# EAGLE design Prototipo_1.0 (EAGLE 6.1)
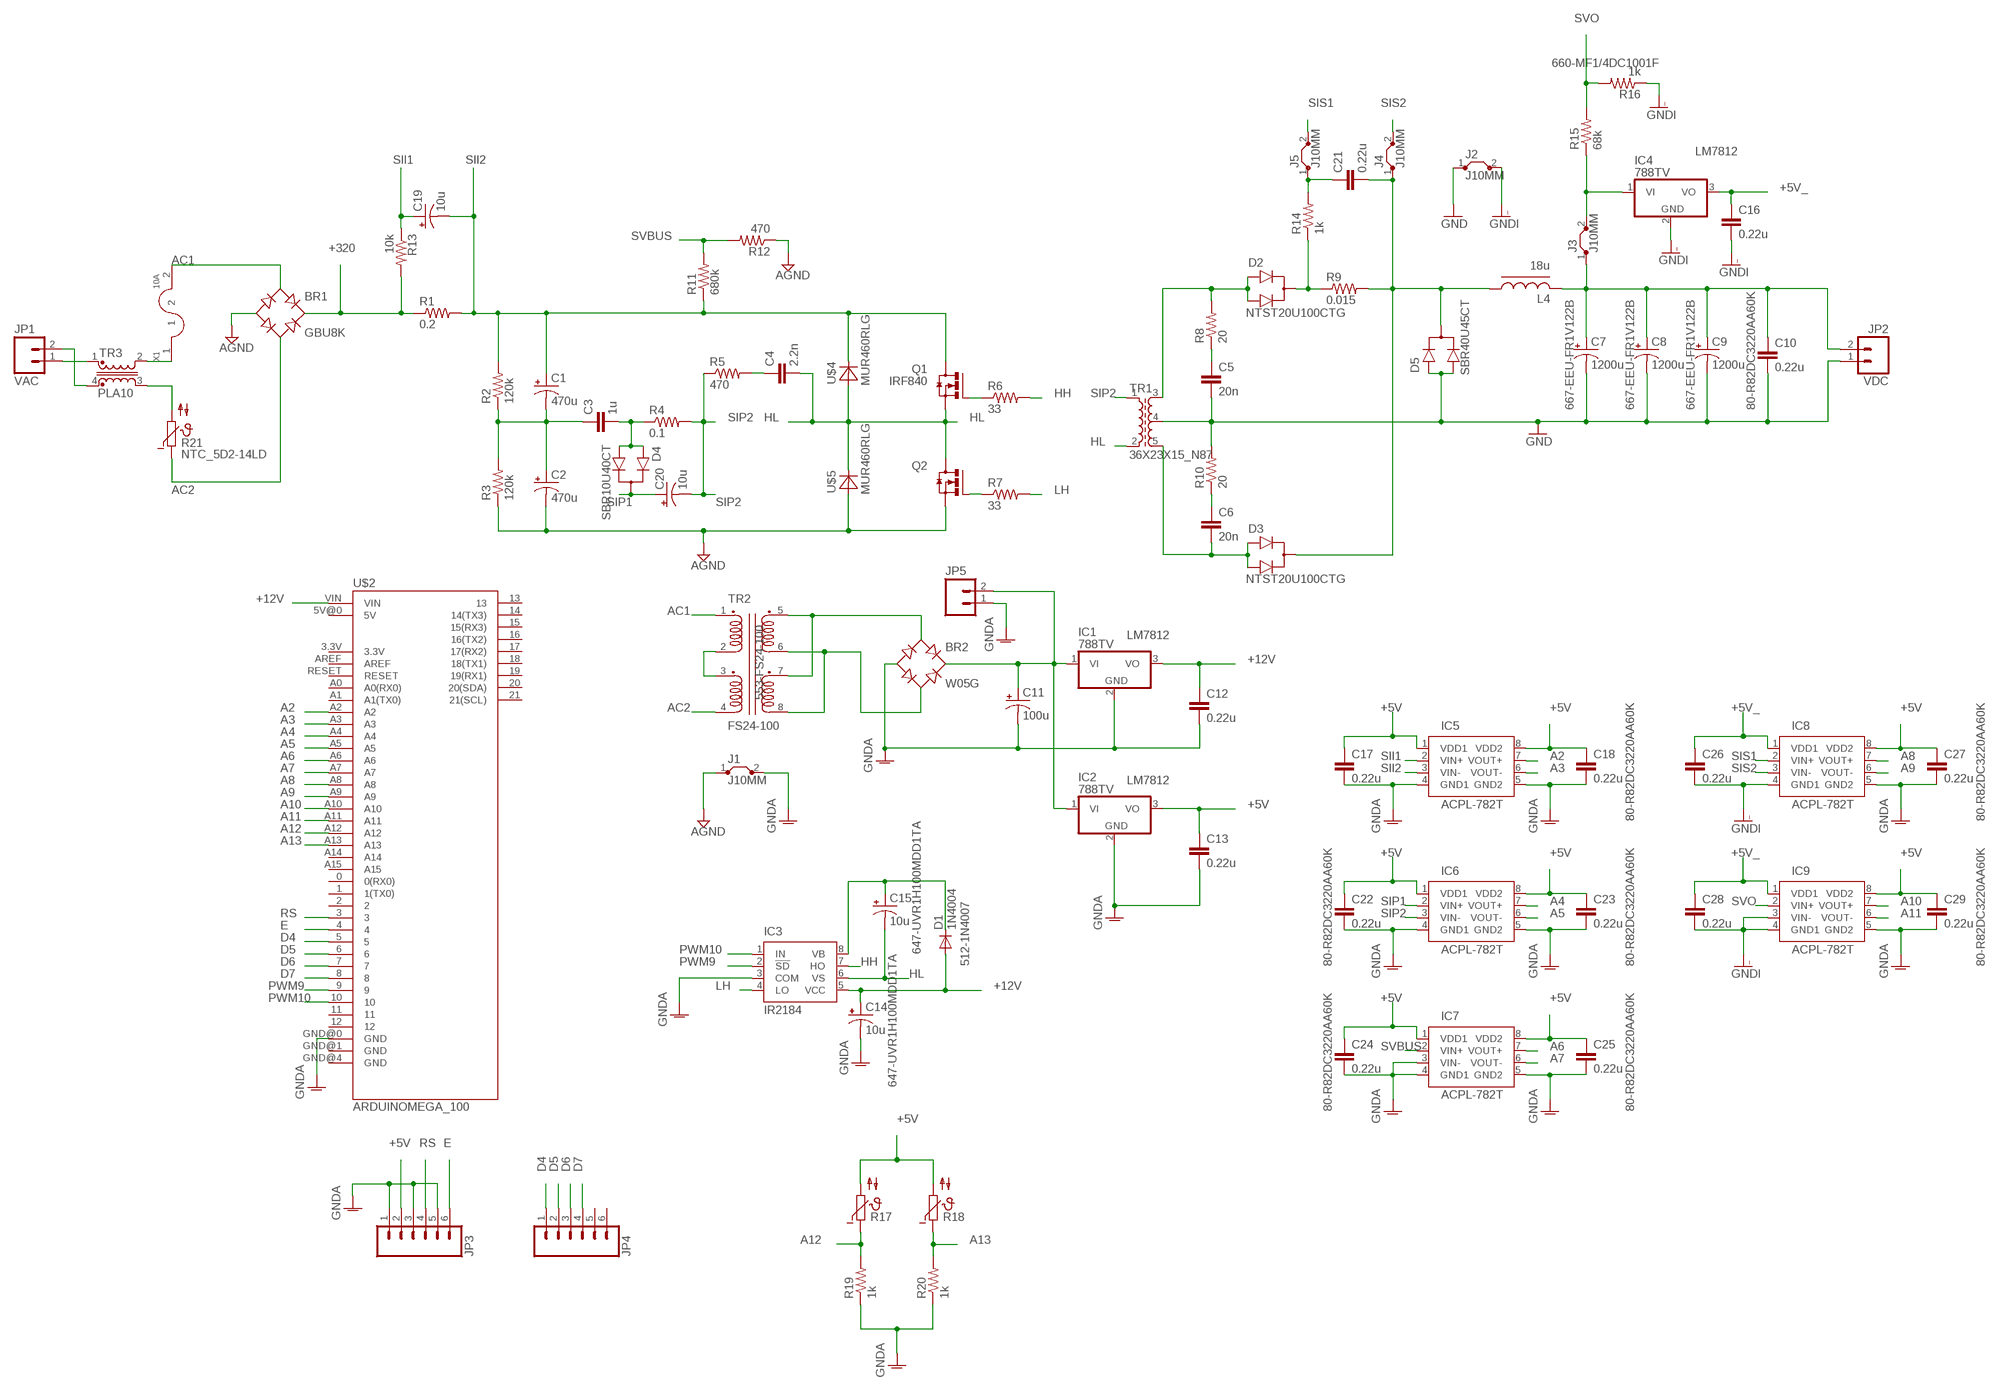
[diagram p0: schematic, sheet 1]

## Parts
BR1  GBU8K  [GBU]
BR2  W05G  [WOG]
C1  470u  CAP_470UF_250V  [CPOL_RADIAL_470UF_250V]
C2  470u  CAP_470UF_250V  [CPOL_RADIAL_470UF_250V]
C3  1u  C22/8  [C22.5B8]
C4  2.2n  C7.5/4  [C7.5B4]
C5  20n  C10/4  [C10B4]
C6  20n  C10/4  [C10B4]
C7  1200u  CAP_POLPTH4  [CPOL-RADIAL-1000UF-25V]
C8  1200u  CAP_POLPTH4  [CPOL-RADIAL-1000UF-25V]
C9  1200u  CAP_POLPTH4  [CPOL-RADIAL-1000UF-25V]
C10  0.22u  C5/3  [C5B3]
C11  100u  CPOL-USE3.5-8  [E3,5-8]
C12  0.22u  C5/3  [C5B3]
C13  0.22u  C5/3  [C5B3]
C14  10u  CPOL-USE2,5-6E  [E2,5-6E]
C15  10u  CPOL-USE2,5-6E  [E2,5-6E]
C16  0.22u  C5/3  [C5B3]
C17  0.22u  C5/3  [C5B3]
C18  0.22u  C5/3  [C5B3]
C19  10u  CPOL-USE2,5-6E  [E2,5-6E]
C20  10u  CPOL-USE2,5-6E  [E2,5-6E]
C21  0.22u  C5/3  [C5B3]
C22  0.22u  C5/3  [C5B3]
C23  0.22u  C5/3  [C5B3]
C24  0.22u  C5/3  [C5B3]
C25  0.22u  C5/3  [C5B3]
C26  0.22u  C5/3  [C5B3]
C27  0.22u  C5/3  [C5B3]
C28  0.22u  C5/3  [C5B3]
C29  0.22u  C5/3  [C5B3]
D1  1N4004  [DO41-10]
D2  NTST20U100CTG  [TO220V]
D3  NTST20U100CTG  [TO220V]
D4  SBR10U40CT  [TO220V]
D5  SBR40U45CT  [TO220V]
IC1  788TV  [TO220V]
IC2  788TV  [TO220V]
IC3  IR2184  [DIL08]
IC4  788TV  [TO220V]
IC5  ACPL-782T  [DIL08]
IC6  ACPL-782T  [DIL08]
IC7  ACPL-782T  [DIL08]
IC8  ACPL-782T  [DIL08]
IC9  ACPL-782T  [DIL08]
J1  J10MM  [10]
J2  J10MM  [10]
J3  J10MM  [10]
J4  J10MM  [10]
J5  J10MM  [10]
JP1  VAC  M023.5MM  [SCREWTERMINAL-3.5MM-2]
JP2  VDC  M025MM  [SCREWTERMINAL-5MM-2]
JP3  M06SIP  [1X06]
JP4  M06SIP  [1X06]
JP5  M02LOCK_LONGPADS  [1X02_LOCK_LONGPADS]
L4  18u  CHOKE_18U  [CHOKE_18U]
Q1  IRF840  [TO220HV]
Q2  IRF840  [TO220HV]
R1  0.2  RESISTORPTH-1W  [AXIAL-0.6]
R2  120k  RESISTORPTH-1/4W  [AXIAL-0.4]
R3  120k  RESISTORPTH-1/4W  [AXIAL-0.4]
R4  0.1  RESISTOR_2W  [RESISTOR_2W]
R5  470  R-US_0922V  [0922V]
R6  33  RESISTORPTH-1/2W  [AXIAL-0.5]
R7  33  RESISTORPTH-1/2W  [AXIAL-0.5]
R8  20  RESISTORPTH-1/2W  [AXIAL-0.5]
R9  0.015  RSENSE  [RSENSE]
R10  20  RESISTORPTH-1/2W  [AXIAL-0.5]
R11  680k  RESISTORPTH-1/4W  [AXIAL-0.4]
R12  470  RESISTORPTH-1/4W  [AXIAL-0.4]
R13  10k  RESISTORPTH-1/4W  [AXIAL-0.4]
R14  1k  RESISTORPTH-1/4W  [AXIAL-0.4]
R15  68k  RESISTORPTH-1/4W  [AXIAL-0.4]
R16  1k  RESISTORPTH-1/4W  [AXIAL-0.4]
R17  NTC640  [P640]
R18  NTC640  [P640]
R19  1k  RESISTORPTH-1/4W  [AXIAL-0.4]
R20  1k  RESISTORPTH-1/4W  [AXIAL-0.4]
R21  NTC_5D2-14LD  [C075-042X103]
TR1  36X23X15_N87  [CORE_36X23X15]
TR2  FS24-100  [FS24-100]
TR3  PLA10  COMMON_MODE_CHOKE_PLA10  [COMMON_MODE_CHOKE_PLA10]
U$2  ARDUINOMEGA_100  [ARDUINOMEGA_100]
U$4  MUR460RLG  [CB429-17]
U$5  MUR460RLG  [CB429-17]
X1  10A  FUSE_HOLDER_5X20  [FUSE_HOLDER_5X20]

## Nets
$N15 [LVHC]: C21.2 D3.2(C) D5.2(C) J4.1 L4.1 R9.P$2
+5V: C13.1 C17.1 C18.1 C22.1 C23.1 C24.1 C25.1 C27.1 C29.1 IC2.3(VO) IC5.1(VDD1) IC5.8(VDD2) IC6.1(VDD1) IC6.8(VDD2) IC7.1(VDD1) IC7.8(VDD2) IC8.8(VDD2) IC9.8(VDD2) JP3.2 R17.2 R18.2
+5V_ [LVLC]: C16.1 C26.1 C28.1 IC4.3(VO) IC8.1(VDD1) IC9.1(VDD1)
+12V [HVMC]: C12.1 C14.+ D1.A IC1.3(VO) IC3.5(VCC) U$2.VIN
+320 [HVHC]: BR1.4(+) R1.P$1 R13.P$2
A2: IC5.7(VOUT+) U$2.A2
A3: IC5.6(VOUT-) U$2.A3
A4: IC6.7(VOUT+) U$2.A4
A5: IC6.6(VOUT-) U$2.A5
A6: IC7.7(VOUT+) U$2.A6
A7: IC7.6(VOUT-) U$2.A7
A8: IC8.7(VOUT+) U$2.A8
A9: IC8.6(VOUT-) U$2.A9
A10: IC9.7(VOUT+) U$2.A10
A11: IC9.6(VOUT-) U$2.A11
A12: R17.1 R19.P$2 U$2.A12
A13: R18.1 R20.P$2 U$2.A13
AC1 [HVHC]: BR1.2(AC1) TR2.1(P1.1) X1.2
AC2 [HVHC]: BR1.3(AC2) R21.1 TR2.4(P2.2)
AGND [HVHC]: BR1.1(-) C2.2(-) J1.1 Q2.3(S) R3.P$1 R12.P$1 U$5.A
D4: JP4.1 U$2.5
D5: JP4.2 U$2.6
D6: JP4.3 U$2.7
D7: JP4.4 U$2.8
E: JP3.6 U$2.4
GND [LVHC]: C5.2 C7.2(-) C8.2(-) C9.2(-) C10.2 D5.1(A1) D5.3(A2) J2.1 JP2.1 R10.P$2 TR1.4
GNDA [HVHC]: BR2.- C11.- C12.2 C13.2 C14.- C17.2 C18.2 C22.2 C23.2 C24.2 C25.2 C27.2 C29.2 IC1.2(GND) IC2.2(GND) IC3.3(COM) IC5.4(GND1) IC5.5(GND2) IC6.4(GND1) IC6.5(GND2) IC7.3(VIN-) IC7.4(GND1) IC7.5(GND2) IC8.5(GND2) IC9.5(GND2) J1.2 JP3.1 JP3.3 JP3.5 JP5.1 R19.P$1 R20.P$1 U$2.GND@0(GND)
GNDI [LVLC]: C16.2 C26.2 C28.2 IC4.2(GND) IC8.4(GND1) IC9.3(VIN-) IC9.4(GND1) J2.2 R16.P$1
HH: IC3.7(HO) R6.P$2
HL [HVHC]: C4.2 C15.- IC3.6(VS) Q1.3(S) Q2.2(D) TR1.2 U$4.A U$5.C
LH: IC3.4(LO) R7.P$2
N$1 [HVHC]: TR2.2(P1.2) TR2.3(P2.1)
N$2 [HVHC]: R21.2 TR3.3
N$3 [HVHC]: C1.2(-) C2.1(+) C3.1 R2.P$1 R3.P$2
N$4 [LVLC]: IC4.1(VI) J3.2 R15.P$1
N$5 [HVHC]: TR3.2 X1.1
N$6 [HVHC]: C3.2 D4.1(A1) D4.3(A2) R4.1
N$7 [HVHC]: C4.1 R5.2
N$8 [HVHC]: JP1.1 TR3.1
N$9 [HVHC]: JP1.2 TR3.4
N$10: Q1.1(G) R6.P$1
N$11: Q2.1(G) R7.P$1
N$12 [LVHC]: C5.1 R8.P$1
N$13 [LVHC]: D2.1(A1) D2.3(A2) R8.P$2 TR1.3
N$14 [LVSHC]: C7.1(+) C8.1(+) C9.1(+) C10.1 J3.1 JP2.2 L4.2
N$15 [HVMC]: BR2.AC1 TR2.5(S1.1) TR2.7(S2.1)
N$16 [LVHC]: D2.2(C) R9.P$1 R14.P$1
N$17 [LVHC]: C6.1 R10.P$1
N$19 [LVHC]: C6.2 D3.1(A1) D3.3(A2) TR1.5
N$20 [HVMC]: BR2.AC2 TR2.6(S1.2) TR2.8(S2.2)
N$21 [HVMC]: BR2.+ C11.+ IC1.1(VI) IC2.1(VI) JP5.2
N$23 [LVHC]: C21.1 J5.1 R14.P$2
N$26: C15.+ D1.C IC3.8(VB)
PWM9: IC3.2(!SD) U$2.9
PWM10: IC3.1(IN) U$2.10
RS: JP3.4 U$2.3
SII1: C19.+ IC5.2(VIN+) R13.P$1
SII2 [HVHC]: C1.1(+) C19.- IC5.3(VIN-) Q1.2(D) R1.P$2 R2.P$2 R11.P$1 U$4.C
SIP1: C20.+ D4.2(C) IC6.2(VIN+)
SIP2 [HVHC]: C20.- IC6.3(VIN-) R4.2 R5.1 TR1.1
SIS1 [LVLC]: IC8.2(VIN+) J5.2
SIS2 [LVLC]: IC8.3(VIN-) J4.2
SVBUS: IC7.2(VIN+) R11.P$2 R12.P$2
SVO [LVLC]: IC9.2(VIN+) R15.P$2 R16.P$2
Unconnected: JP4.5 JP4.6 U$2.0(0(RX0)) U$2.1(1(TX0)) U$2.2 U$2.3.3V U$2.5V@0(5V) U$2.11 U$2.12 U$2.13 U$2.14(14(TX3)) U$2.15(15(RX3)) U$2.16(16(TX2)) U$2.17(17(RX2)) U$2.18(18(TX1)) U$2.19(19(RX1)) U$2.20(20(SDA)) U$2.21(21(SCL)) U$2.A0(A0(RX0)) U$2.A1(A1(TX0)) U$2.A14 U$2.A15 U$2.AREF U$2.GND@1(GND) U$2.GND@4(GND) U$2.RESET

## Library data of the parts
BR1 = finger_sun:GBU8K
BR2 = dbridge:W*G: Vishay/General Semiconductor W005G - W10G Bridge rectifier, 1.5A, 50 to 1000V; MOUSER: 625-W06G-E4
C1 C2 = finger_sun:CAP_470UF_250V: Capacitor Polarized These are standard SMD and PTH capacitors. Normally 10uF, 47uF, and 100uF in electrolytic and tantalum varieties. Always verify the external diameter of the through hole cap, it varies with capacity, voltage, and manufacturer. The EIA devices should be standard.
C3 C4 = capacitor-wima:C: CAPACITOR naming: grid - package width
C5 C6 = capacitor-wima:C: CAPACITOR naming: grid - package width; MOUSER: 594-S203M75Z5UN63J0R
C7-C9 = SparkFun-Passives:CAP_POL: Capacitor Polarized These are standard SMD and PTH capacitors. Normally 10uF, 47uF, and 100uF in electrolytic and tantalum varieties. Always verify the external diameter of the through hole cap, it varies with capacity, voltage, and manufacturer. The EIA devices should be standard.; MOUSER: 667-EEU-FR1V122B
C10 C12 C13 C16-C18 C21-C29 = capacitor-wima:C: CAPACITOR naming: grid - package width; MOUSER: 80-R82DC3220AA60K
C11 = adafruit:CPOL-US: POLARIZED CAPACITOR, American symbol; MOUSER: 140-REA101M1HBK0811P
C14 C15 C19 C20 = adafruit:CPOL-US: POLARIZED CAPACITOR, American symbol; MOUSER: 647-UVR1H100MDD1TA
D1 = diode:1N4004: DIODE general purpose rectifier, 1 A; MOUSER: 512-1N4007
D2 D3 = finger_sun:NTST20U100CTG
D4 = finger_sun:SBR10U40CT
D5 = finger_sun:SBR40U45CT
IC1 = linear:78*: Positive VOLTAGE REGULATOR Source: http://cache.national.com/ds/LM/LM78L05.pdf http://www.fairchildsemi.com/ds/LM/LM7805.pdf; MODEL: LM7812; MOUSER: 863-MC7812CTG
IC2 IC4 = linear:78*: Positive VOLTAGE REGULATOR Source: http://cache.national.com/ds/LM/LM78L05.pdf http://www.fairchildsemi.com/ds/LM/LM7805.pdf; MODEL: LM7812; MOUSER: 863-MC7805CTG
IC3 = finger_sun:IR2184: HALF-BRIDGE DRIVER www.irf.com Data Sheet No. PD60174 revG Features *Floating channel designed for bootstrap operation Fully operational to +600V *Tolerant to negative transient voltage dV/dt immune * Gate drive supply range from 10 to 20V * Undervoltage lockout for both channels * 3.3V and 5V input logic compatible * Matched propagation delay for both channels * Logic and power ground +/- 5V offset. * Lower di/dt gate driver for better noise immunity * Output source/sink current capability 1.4A/1.8A * Also available LEAD-FREE (PbF); MF: INTERNATIONAL RECTIFIER(IR); MPN: IR2184
IC5-IC9 = finger_sun:ACPL-782T
J1-J5 = jumper:J: Bridge
JP1 JP2 JP5 = SparkFun-Connectors:M02: Header 2 Standard 2-pin 0.1" header. Use with straight break away headers (SKU : PRT-00116), right angle break away headers (PRT-00553), swiss pins (PRT-00743), machine pins (PRT-00117), and female headers (PRT-00115). Molex polarized connector foot print use with SKU : PRT-08233 with associated crimp pins and housings.
JP3 JP4 = SparkFun-Connectors:M06: Header 6 Standard 6-pin 0.1" header. Use with straight break away headers (SKU : PRT-00116), right angle break away headers (PRT-00553), swiss pins (PRT-00743), machine pins (PRT-00117), and female headers (PRT-00115). Molex polarized connector foot print use with SKU : PRT-08094 with associated crimp pins and housings. NOTES ON THE VARIANTS LOCK and LOCK_LONGPADS... This footprint was designed to help hold the alignment of a through-hole component (i.e. 6-pin header) while soldering it into place. You may notice that each hole has been shifted either up or down by 0.005 of an inch from it's more standard position (which is a perfectly straight line). This slight alteration caused the pins (the squares in the middle) to touch the edges of the holes. Because they are alternating, it causes a "brace" to hold the component in place. 0.005 has proven to be the perfect amount of "off-center" position when using our standard breakaway headers. Although looks a little odd when you look at the bare footprint, once you have a header in there, the alteration is very hard to notice. Also, if you push a header all the way into place, it is covered up entirely on the bottom side. This idea of altering the position of holes to aid alignment will be further integrated into the Sparkfun Library for other footprints. It can help hold any component with 3 or more connection pins.
L4 = finger_sun:CHOKE_18U: Choke Toroid 18uH 18.5A 652-2300LL-180-V-RC
Q1 Q2 = finger_sun:IRF840
R1 R6 R7 = SparkFun-Passives:RESISTOR: Resistor Basic schematic elements and footprints for 0603, 1206, and PTH resistors.
R2 R3 = SparkFun-Passives:RESISTOR: Resistor Basic schematic elements and footprints for 0603, 1206, and PTH resistors.; MOUSER: 660-MF1/4DCT52R1203F
R4 = finger_sun:RESISTOR_2W
R5 = adafruit:R-US_: RESISTOR, American symbol
R8 R10 = SparkFun-Passives:RESISTOR: Resistor Basic schematic elements and footprints for 0603, 1206, and PTH resistors.; MOUSER: 603-MFR50SFTE52-20R
R9 = finger_sun:RSENSE: Open Air Sense Resistor - TT Electronics
R11 = SparkFun-Passives:RESISTOR: Resistor Basic schematic elements and footprints for 0603, 1206, and PTH resistors.; MOUSER: 660-MF1/4DC6803F
R12 = SparkFun-Passives:RESISTOR: Resistor Basic schematic elements and footprints for 0603, 1206, and PTH resistors.; MOUSER: 660-MF1/4DC4700F
R13 = SparkFun-Passives:RESISTOR: Resistor Basic schematic elements and footprints for 0603, 1206, and PTH resistors.; MOUSER: 660-MF1/4DC1002F
R14 R16 R19 R20 = SparkFun-Passives:RESISTOR: Resistor Basic schematic elements and footprints for 0603, 1206, and PTH resistors.; MOUSER: 660-MF1/4DC1001F
R15 = SparkFun-Passives:RESISTOR: Resistor Basic schematic elements and footprints for 0603, 1206, and PTH resistors.; MOUSER: 660-MF1/4DC6802F
R17 R18 = ptc-ntc:NTC640: PHILIPS NTC; MOUSER: 594-NTCLE203E3502JB0; OC_FARNELL: unknown; OC_NEWARK: unknown
R21 = finger_sun:NTC_5D2-14LD
TR1 = finger_sun:36X23X15_N87
TR2 = finger_sun:FS24-100: Transformer 110+110/12+12 2.5VA Triad Magnetics FS24-100; MOUSER: 553-FS24-100
TR3 = finger_sun:COMMON_MODE_CHOKE_PLA10: Common Mode Choke (EMI Filter) PLA10
U$2 = prymia:ARDUINOMEGA_100
U$4 U$5 = finger_sun:MUR460RLG
X1 = finger_sun:FUSE_HOLDER_5X20: Fuse Holder - Fuse Cartridge 5x20mm

## Net classes
0 HVLC: clearance 0.889 mm
1 HVHC: width 0.762 mm, clearance 1.27 mm to class 0, clearance 1.27 mm
2 LVHC: width 2.794 mm, clearance 5.08 mm to class 0, clearance 5.08 mm to class 1
3 LVLC: width 0.381 mm, clearance 5.08 mm to class 0, clearance 5.08 mm to class 1
4 LVSHC: width 5.08 mm, clearance 5.08 mm to class 0, clearance 5.08 mm to class 1
5 HVMC: width 0.762 mm, clearance 0.889 mm to class 0, clearance 1.27 mm to class 1, clearance 5.08 mm to class 2, clearance 5.08 mm to class 3, clearance 5.08 mm to class 4, clearance 0.889 mm

## Board
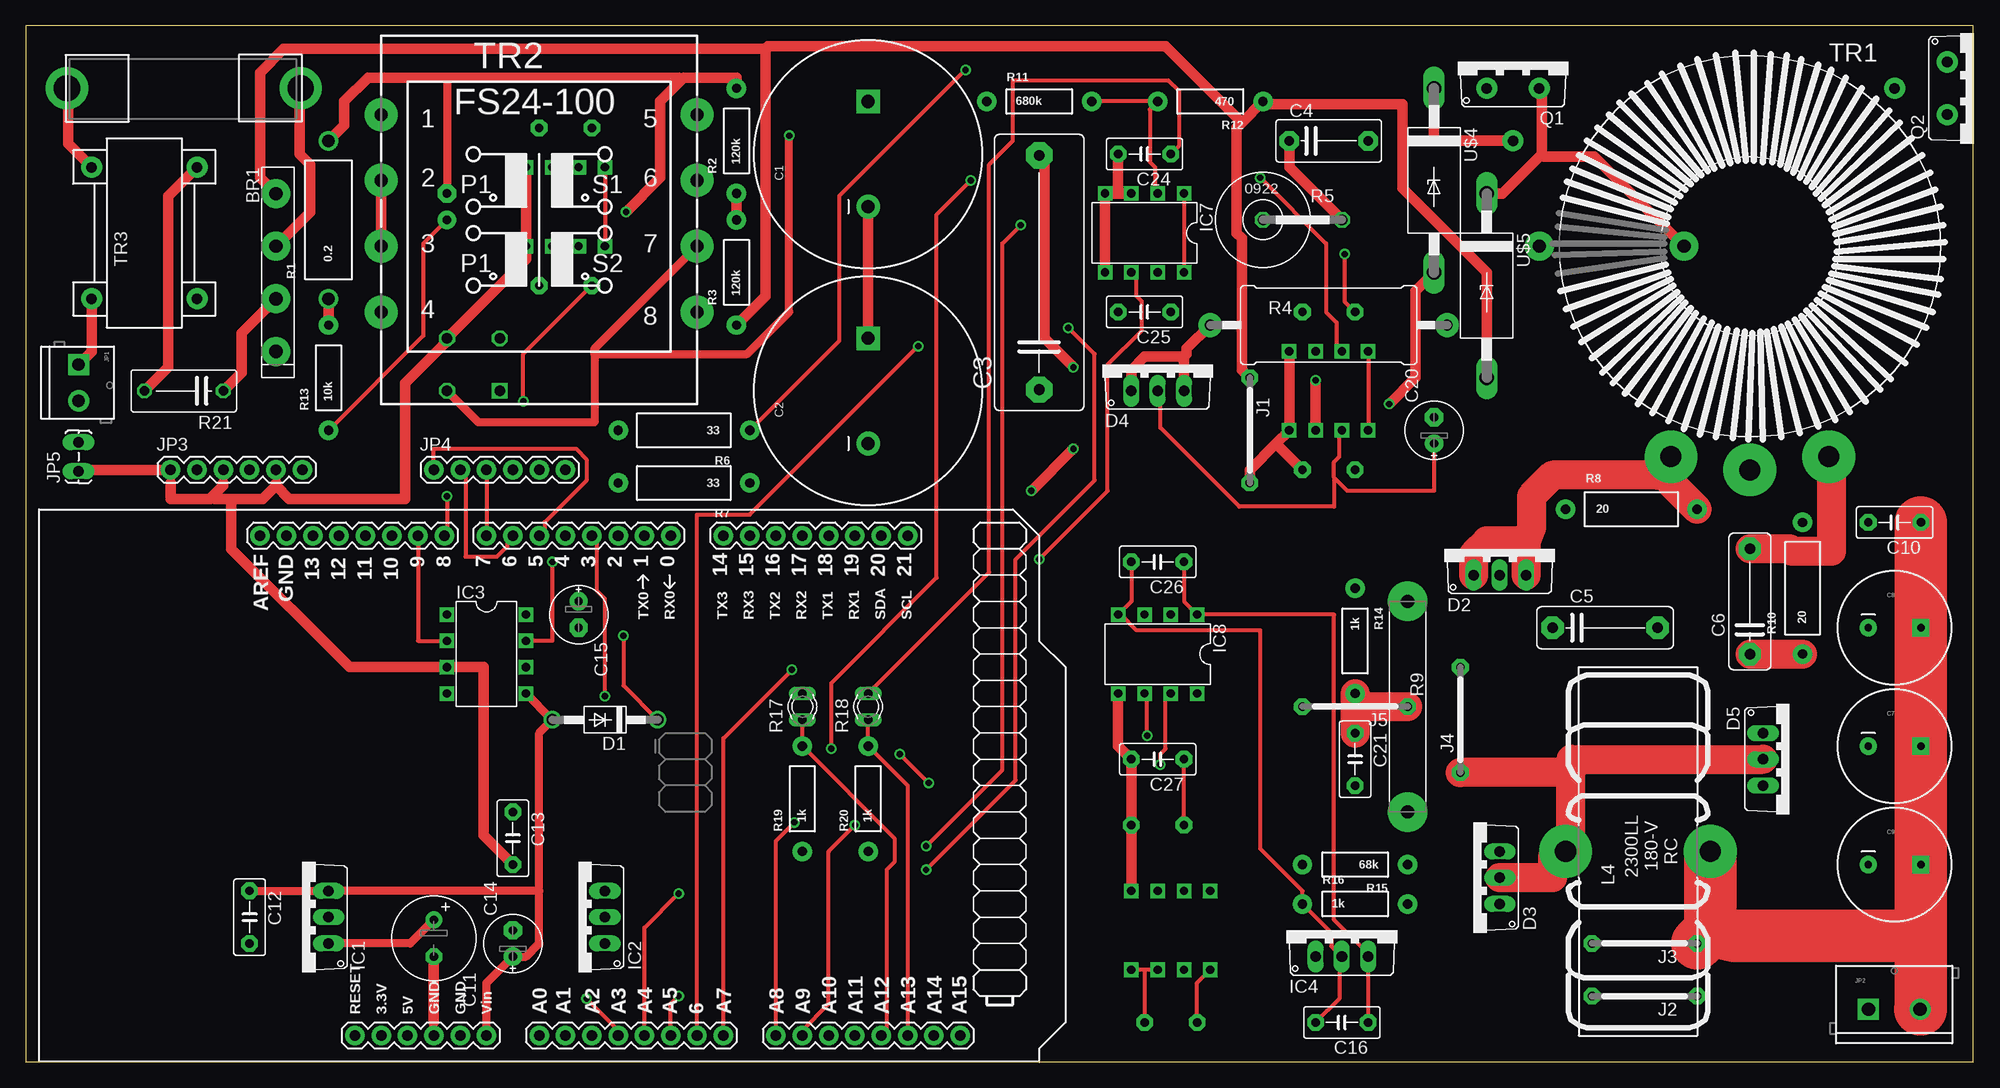
[diagram p1: board, top side]
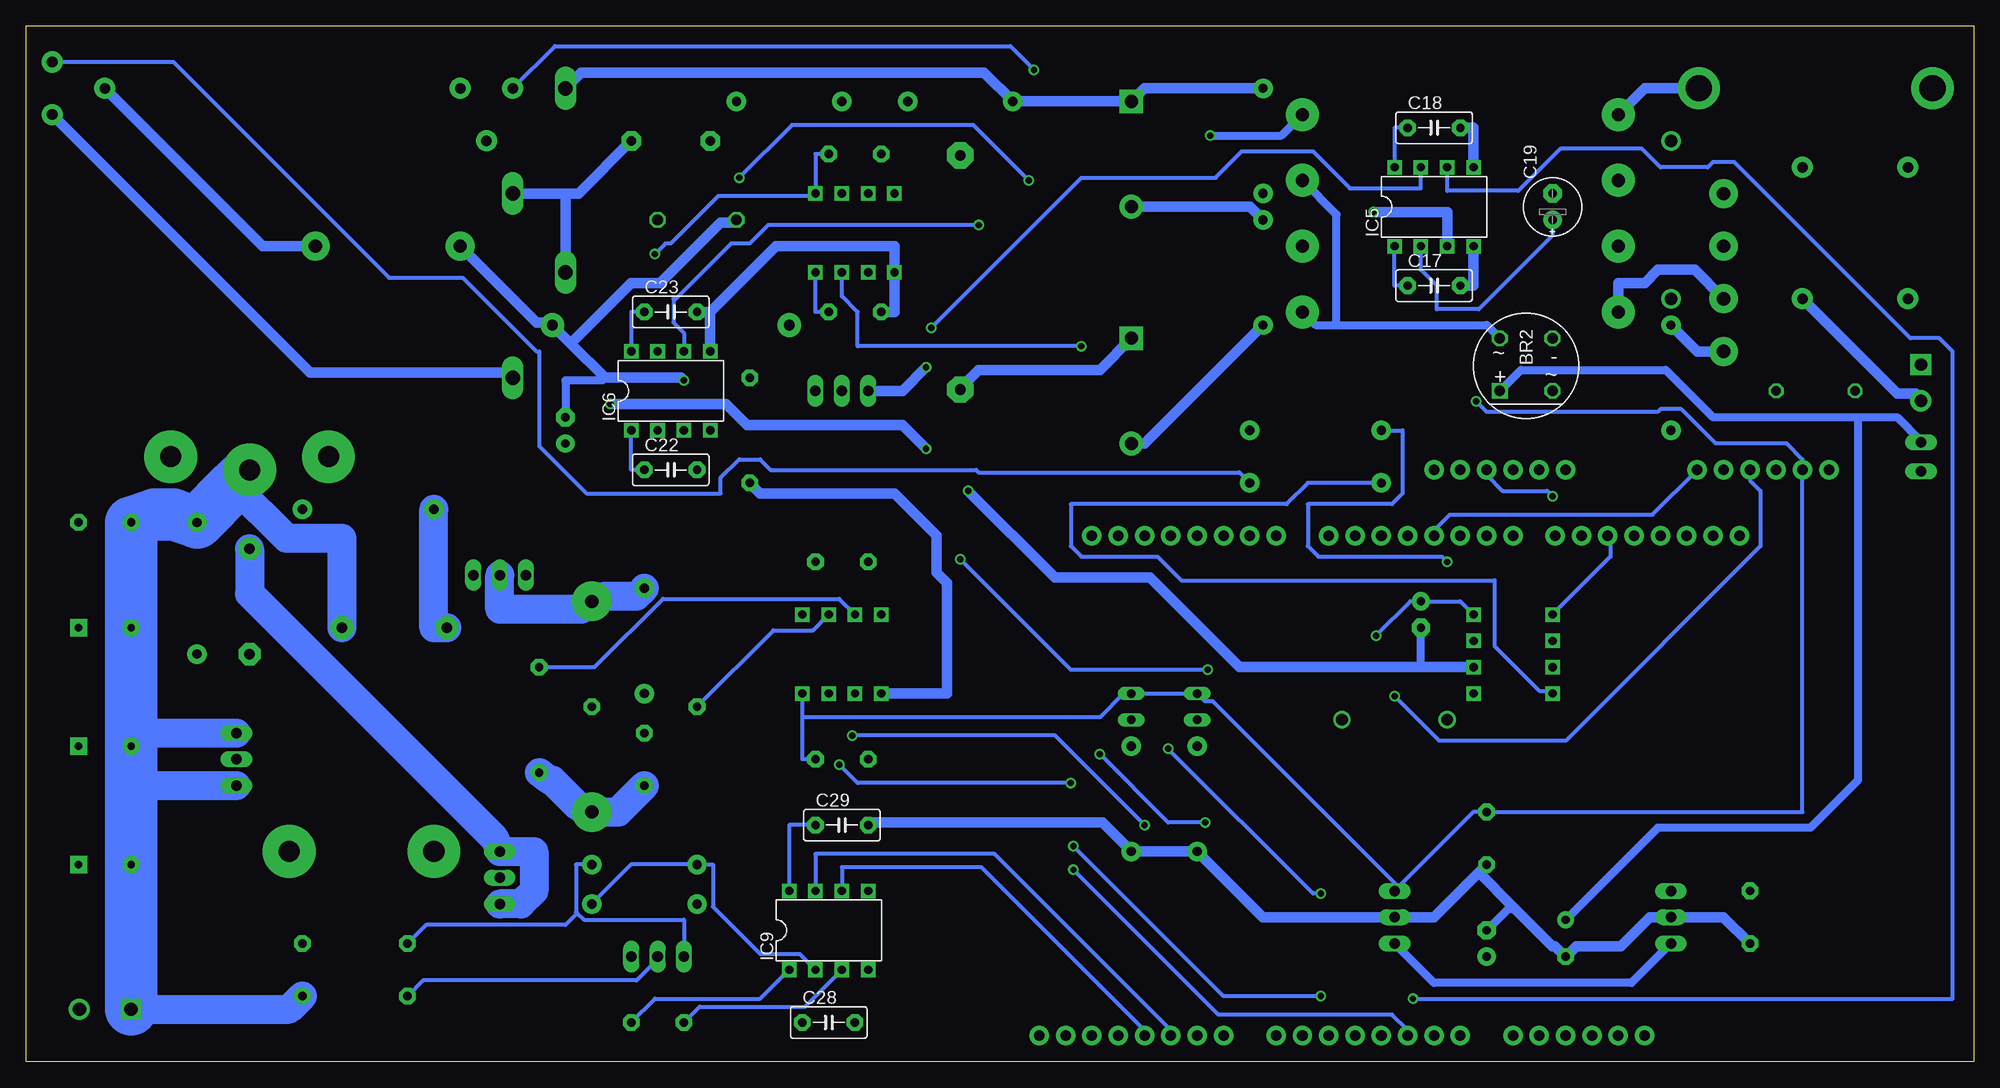
[diagram p2: board, bottom side, seen from below]

Size 187.94 x 100 mm. Coordinates in mm from the lower left corner, seen from the top.
Outline: 0,0 187.94,0 187.94,100 0,100 0,0
Copper layers (1*16): Top 0.035mm / dielectric 1.5mm / Bottom 0.035mm
Design rules: minimum track width 15mil, minimum drill 24mil, track to track 15mil, track to pad 15mil, pad to pad 15mil, via to via 15mil, smd to smd 15mil, copper to edge 40mil, drill to drill 8mil, minimum pad ring 10mil, minimum via ring 8mil, stop-mask expansion 4mil, vias tented up to drill 0mil, thermal gap 10mil

### Footprints (pad centres in the part's own frame; a part is rotated, then mirrored left to right if it is on the bottom)
GBU = drill 1.27 pad 2.794: 1 -5.08,0; 2 0,0; 3 5.08,0; 4 10.16,0
WOG = drill 1.016 square: + 2.54,2.54 | drill 1.016 octagon: - -2.54,-2.54; AC1 -2.54,2.54; AC2 2.54,-2.54
CPOL_RADIAL_470UF_250V = drill 1.27 pad 2.286 square: 1 5.08,0 | drill 1.27 pad 2.286: 2 -5.08,0
C22.5B8 = drill 1.016 pad 2.54 octagon: 1 -11.303,0; 2 11.303,0
C7.5B4 = drill 0.914 pad 1.905 octagon: 1 -3.81,0; 2 3.81,0
C10B4 = drill 1.016 pad 2.159 octagon: 1 -5.08,0; 2 5.08,0
CPOL-RADIAL-1000UF-25V = drill 0.7 pad 1.651 square: 1 2.54,0 | drill 0.7 pad 1.651: 2 -2.54,0
C5B3 = drill 0.813 pad 1.6 octagon: 1 -2.54,0; 2 2.54,0
E3,5-8 = drill 0.813 pad 1.6: + -1.778,0 | drill 0.813 pad 1.6 octagon: - 1.778,0
E2,5-6E = drill 0.813 pad 1.778: + -1.27,0 | drill 0.813 pad 1.778 octagon: - 1.27,0
DO41-10 = drill 1.118: A 5.08,0; C -5.08,0
TO220V = drill 1.016 long: 1 -2.54,-2.54; 2 0,-2.54; 3 2.54,-2.54
DIL08 = drill 0.8 pad 1.4 square: 1 -3.81,-3.81; 2 -1.27,-3.81; 3 1.27,-3.81; 4 3.81,-3.81; 5 3.81,3.81; 6 1.27,3.81; 7 -1.27,3.81; 8 -3.81,3.81
10 = drill 0.813 pad 1.6 octagon: 1 -5.08,0; 2 5.08,0
SCREWTERMINAL-3.5MM-2 = drill 1.2 pad 2.032 square: 1 0,0 | drill 1.2 pad 2.032: 2 3.5,0
SCREWTERMINAL-5MM-2 = drill 1.3 pad 2.032 square: 1 0,0 | drill 1.3 pad 2.032: 2 5,0
1X06 = drill 1.016 pad 1.88: 1 0,0; 2 2.54,0; 3 5.08,0; 4 7.62,0; 5 10.16,0; 6 12.7,0
1X02_LOCK_LONGPADS = drill 1.016 long: 1 -0.127,0; 2 2.667,0
CHOKE_18U = drill 2.032 pad 5.08: 1 0,0; 2 0,-13.97
TO220HV = drill 1.016 pad 2.032: 1 -2.54,0; 2 0,-5.08; 3 2.54,0
AXIAL-0.6 = drill 1.2 pad 1.88: P$1 -7.62,0; P$2 7.62,0
AXIAL-0.4 = drill 0.9 pad 1.88: P$1 -5.08,0; P$2 5.08,0
RESISTOR_2W = drill 1.016 pad 2.286: 1 -12.7,0; 2 10.16,0
0922V = drill 1.016 octagon: 1 -5.08,0; 2 2.54,0
AXIAL-0.5 = drill 0.9 pad 1.88: P$1 -6.35,0; P$2 6.35,0
RSENSE = drill 1.27 pad 3.81: P$1 -10.16,0; P$2 10.16,0
P640 = drill 0.813 long: 1 -1.27,0; 2 1.27,0
C075-042X103 = drill 0.914 octagon: 1 -3.81,0; 2 3.81,0
CORE_36X23X15 = drill 1.27 pad 2.794: 1 -20.32,0; 2 -6.35,0 | drill 2.032 pad 5.08: 3 -7.62,-20.32; 4 0,-21.59; 5 7.62,-20.32
FS24-100 = drill 1.27 pad 3.175: 1 -15.24,10.16; 2 -15.24,3.81; 3 -15.24,-2.54; 4 -15.24,-8.89; 5 15.24,10.16; 6 15.24,3.81; 7 15.24,-2.54; 8 15.24,-8.89
COMMON_MODE_CHOKE_PLA10 = drill 1.016 pad 2.032: 1 -6.35,5.08; 2 6.35,5.08; 3 6.35,-5.08; 4 -6.35,-5.08
ARDUINOMEGA_100 = drill 1.016 pad 1.88: 0 60.96,50.8; 1 58.42,50.8; 2 55.88,50.8; 3 53.34,50.8; 3.3V 33.02,2.54; 4 50.8,50.8; 5 48.26,50.8; 5V@0 35.56,2.54; 6 45.72,50.8; 7 43.18,50.8; 8 39.116,50.8; 9 36.576,50.8; 10 34.036,50.8; 11 31.496,50.8; 12 28.956,50.8; 13 26.416,50.8; 14 66.04,50.8; 15 68.58,50.8; 16 71.12,50.8; 17 73.66,50.8; 18 76.2,50.8; 19 78.74,50.8; 20 81.28,50.8; 21 83.82,50.8; A0 48.26,2.54; A1 50.8,2.54; A2 53.34,2.54; A3 55.88,2.54; A4 58.42,2.54; A5 60.96,2.54; A6 63.5,2.54; A7 66.04,2.54; A8 71.12,2.54; A9 73.66,2.54; A10 76.2,2.54; A11 78.74,2.54; A12 81.28,2.54; A13 83.82,2.54; A14 86.36,2.54; A15 88.9,2.54; AREF 21.336,50.8; GND@0 38.1,2.54; GND@1 40.64,2.54; GND@4 23.876,50.8; RESET 30.48,2.54; VIN 43.18,2.54
CB429-17 = drill 1.397 long: A 8.89,0; C -8.89,0
FUSE_HOLDER_5X20 = drill 2.54 pad 4.064: 1 0,12.54; 2 0,-10

### Placement (x,y rotation side)
BR1  24.13,78.74 270 top
BR2  43.18,67.31 180 bottom
C1  81.28,87.63 90 top
C2  81.28,64.77 90 top
C3  97.79,76.2 90 top
C4  125.73,88.9 0 top
C5  152.4,41.91 0 top
C6  166.37,44.45 90 top
C7  180.34,30.48 0 top
C8  180.34,41.91 0 top
C9  180.34,19.05 0 top
C10  180.34,52.07 180 top
C11  39.37,11.94 270 top
C12  21.59,13.97 270 top
C13  46.99,21.59 270 top
C14  46.99,11.43 90 top
C15  53.34,43.18 270 top
C16  127,3.81 180 top
C17  52.07,74.93 0 bottom
C18  52.07,90.17 0 bottom
C19  40.64,82.55 90 bottom
C20  135.89,60.96 90 top
C21  128.27,29.21 270 top
C22  125.73,57.15 0 bottom
C23  125.73,72.39 0 bottom
C24  107.95,87.63 180 top
C25  107.95,72.39 180 top
C26  109.22,48.26 180 top
C27  109.22,29.21 180 top
C28  110.49,3.81 0 bottom
C29  109.22,22.86 0 bottom
D1  55.88,33.02 180 top
D2  142.24,49.53 0 top
D3  139.7,17.78 90 top
D4  109.22,67.31 0 top
D5  170.18,29.21 270 top
IC1  26.67,13.97 90 top
IC2  53.34,13.97 90 top
IC3  44.45,39.37 270 top
IC4  127,12.7 0 top
IC5  52.07,82.55 0 bottom
IC6  125.73,64.77 0 bottom
IC7  107.95,80.01 180 top
IC8  109.22,39.37 180 top
IC9  110.49,12.7 0 bottom
J1  118.11,60.96 270 top
J2  156.21,6.35 180 top
J3  156.21,11.43 180 top
J4  138.43,33.02 90 top
J5  128.27,34.29 180 top
JP1  5.08,67.31 270 top
JP2  177.8,5.08 0 top
JP3  13.97,57.15 0 top
JP4  39.37,57.15 0 top
JP5  5.08,57.15 90 top
L4  148.59,20.32 90 top
Q1  143.51,93.98 0 top
Q2  185.42,93.98 270 top
R1  29.21,81.28 90 top
R2  68.58,88.9 90 top
R3  68.58,76.2 90 top
R4  127,71.12 0 top
R5  124.46,81.28 0 top
R6  63.5,60.96 180 top
R7  63.5,55.88 180 top
R8  154.94,53.34 0 top
R9  133.35,34.29 270 top
R10  171.45,45.72 90 top
R11  97.79,92.71 0 top
R12  114.3,92.71 180 top
R13  29.21,66.04 90 top
R14  128.27,40.64 270 top
R15  128.27,19.05 180 top
R16  128.27,15.24 0 top
R17  74.93,34.29 90 top
R18  81.28,34.29 90 top
R19  74.93,25.4 90 top
R20  81.28,25.4 90 top
R21  15.24,64.77 180 top
TR1  166.37,78.74 0 top
TR2  49.53,81.28 0 top
TR3  11.43,80.01 90 top
U$2  1.27,0 0 top
U$4  135.89,85.09 270 top
U$5  140.97,74.93 270 top
X1  16.51,93.98 90 top

### Tracks (layer width: path | path; a pad name or v marks a point on that pad's centre or on a via)
$N15
  Top 2.794: D5.2 149.1,29.21 149.1,27.94 | 149.1,27.94 149.1,21.59 L4.1 147.32,19.81 147.32,17.78 D3.2 | 149.1,27.94 J4.1
  Bottom 2.794: C21.2 130.81,24.13 R9.P$2 134.62,24.64 137.16,27.18 137.41,27.18 J4.1
+5V  (via drill 0.61)
  Top 0.381: IC6.8 IC6.1 | IC7.1 IC7.8 | C23.1 127.25,73.41 v127.25,77.98 | C29.1 C27.1 | IC5.8 IC5.1 | C17.1 48.01,68.33 v48.01,63.75 | C24.1 111.25,88.39 111.25,93.73 110.24,94.74 95.25,94.74 95.25,88.9 92.96,86.61 92.96,47.24 R18.2
  Bottom 0.381: IC6.1 129.54,57.15 C22.1 | IC6.8 129.54,72.39 C23.1 | IC7.8 111.76,72.39 C25.1 | C24.1 111.76,87.63 IC7.1 112.01,83.57 121.16,83.57 125.73,78.99 126.24,78.99 v127.25,77.98 | 113.03,33.27 113.03,29.21 C27.1 | 113.03,33.27 IC8.8 | IC9.8 114.3,22.86 C29.1 | IC5.1 55.88,74.93 C17.1 | IC5.8 55.88,90.17 C18.1 | v48.01,63.75 46.99,62.74 30.48,62.74 30.23,62.99 28.19,62.99 24.89,59.69 18.03,59.69 16.51,58.17 JP3.2 16.51,24.13 C13.1 48.26,24.13 IC2.3 55.63,17.02 73.41,34.8 74.17,34.8 R17.2 R18.2 82.04,35.56 84.33,33.27 113.03,33.27
+5V_
  Top 0.381: IC9.1 113.03,7.62 C28.1 | C26.1 111.76,44.45 IC8.1 126.24,43.18 126.24,13.72 129.54,10.41 IC4.3 C16.1
  Bottom 0.381: IC9.1 117.09,6.1 127.25,6.1 C16.1
+12V
  Top 0.762: C12.1 IC1.3 49.53,16.51 | IC3.5 D1.A 49.53,31.75 49.53,16.51 | U$2.VIN 44.45,7.62 C14.+ 48.26,10.16 49.53,11.43 49.53,16.51
+320
  Top 1.016: R1.P$1 R13.P$2
  Bottom 1.016: R13.P$2 26.67,68.58 BR1.4
A2  (via drill 0.61)
  Top 0.381: v100.58,70.87 103.12,68.33 103.12,56.13 95.5,48.51 95.5,27.18 v86.87,18.54
  Bottom 0.381: IC5.7 53.34,84.33 60.2,84.33 63.75,87.88 70.61,87.88 73.15,85.34 86.11,85.34 v100.58,70.87 | v86.87,18.54 72.9,4.57 56.13,4.57 54.61,3.05 U$2.A2
A3  (via drill 0.61)
  Top 0.381: v54.1,6.1 57.15,3.05 U$2.A3
  Bottom 0.381: IC5.6 50.8,84.07 43.94,84.07 39.88,88.14 32,88.14 30.23,86.36 25.65,86.36 25.15,86.87 23.11,86.87 6.1,69.85 3.3,69.85 2.03,68.58 2.03,6.1 v54.1,6.1
A4  (via drill 0.61)
  Top 0.381: IC6.7 126.49,69.09 126.49,71.37 125.48,72.39 125.48,78.99 v119.13,85.34 | v91.19,85.09 87.88,81.79 87.88,46.74 77.72,36.58 v77.72,30.23 | v62.99,16.26 59.69,12.95 U$2.A4
  Bottom 0.381: v119.13,85.34 114.05,90.42 96.52,90.42 v91.19,85.09 | v77.72,30.23 63.75,16.26 v62.99,16.26
A5  (via drill 0.61)
  Top 0.381: v96.01,80.77 94.23,78.99 94.23,28.19 v86.87,20.83 | v62.99,6.35 62.23,5.59 U$2.A5
  Bottom 0.381: IC6.6 124.46,70.36 125.48,71.37 125.48,73.66 125.22,73.66 119.89,78.99 118.11,78.99 116.33,80.77 v96.01,80.77 | v86.87,20.83 72.39,6.35 v62.99,6.35
A6  (via drill 0.61)
  Top 0.381: v86.11,69.09 69.85,52.83 64.77,52.83 U$2.A6
  Bottom 0.381: IC7.7 109.22,73.91 107.7,72.39 107.7,69.09 v86.11,69.09
A7  (via drill 0.61)
  Top 0.381: IC7.6 107.19,75.69 107.19,73.91 107.7,73.41 107.7,70.61 104.39,67.31 104.39,55.12 v97.79,48.51 | v73.91,37.85 67.31,31.24 U$2.A7
  Bottom 0.381: v97.79,48.51 87.12,37.85 v73.91,37.85
A8  (via drill 0.61)
  Top 0.381: IC8.7 109.98,35.05 109.98,30.23 109.47,29.72 v109.47,28.7 | v84.33,29.72 v87.12,26.92 | v74.17,23.11 72.39,21.34 U$2.A8
  Bottom 0.381: v109.47,28.7 107.7,26.92 v87.12,26.92 | v84.33,29.72 77.72,23.11 v74.17,23.11
A9  (via drill 0.61)
  Top 0.381: IC8.6 108.2,35.31 v108.2,31.5 | v80.01,22.86 77.47,20.32 77.47,5.59 74.93,3.05 U$2.A9
  Bottom 0.381: v108.2,31.5 88.65,31.5 v80.01,22.86
A10
  Bottom 0.381: IC9.7 111.76,20.07 94.49,20.07 77.47,3.05 U$2.A10
A11
  Bottom 0.381: IC9.6 109.22,18.8 95.76,18.8 80.01,3.05 U$2.A11
A12
  Top 0.381: R17.1 R19.P$2 83.82,21.59 83.82,19.3 83.06,18.54 83.06,3.05 U$2.A12
A13
  Top 0.381: R18.1 R20.P$2 85.09,26.67 U$2.A13
AC1
  Top 1.016: BR1.2 27.43,82.04 27.43,86.61 26.42,87.63 26.42,93.98 X1.2
  Bottom 1.016: TR2.1 31.75,93.98 X1.2
AC2
  Top 1.016: R21.1 20.83,66.55 20.83,70.36 BR1.3
  Bottom 1.016: TR2.4 34.29,75.18 31.75,75.18 30.48,76.45 26.92,76.45 BR1.3
AGND
  Top 1.016: J1.1 117.35,66.8 117.35,79.5 116.84,80.01 116.84,90.17 117.35,90.68 | 117.35,90.68 R12.P$1 119.63,92.46 132.84,92.46 132.84,84.33 140.97,76.2 U$5.A | BR1.1 22.61,85.34 22.61,95.5 24.89,97.79 71.37,97.79 | 71.37,97.79 71.37,73.91 R3.P$1 | 117.35,90.68 109.98,98.04 71.63,98.04 71.37,97.79
  Bottom 1.016: Q2.3 160.53,66.55 141.48,66.55 U$5.A | R3.P$1 80.01,59.69 C2.2
D4
  Top 0.381: U$2.5 50.04,51.31 50.04,52.07 54.1,56.13 54.1,58.17 53.09,59.18 39.37,59.18 JP4.1
D5
  Top 0.381: U$2.6 46.48,50.29 46.48,49.78 45.47,48.77 42.42,48.77 42.42,56.64 JP4.2
D6
  Top 0.381: JP4.3 U$2.7
D7  (via drill 0.61)
  Top 0.381: U$2.8 40.64,51.05 v40.64,54.61
  Bottom 0.381: v40.64,54.61 41.15,55.12 45.47,55.12 46.99,56.64 JP4.4
E
  Bottom 0.381: JP3.6 30.99,52.83 50.55,52.83 52.07,51.31 U$2.4
GND
  Bottom 2.794: J2.1 162.56,5.08 JP2.1 | 177.8,26.67 D5.3 | 177.8,31.75 D5.1 | C5.2 157.48,50.55 162.81,50.55 167.89,55.63
  Bottom 5.08: TR1.4 167.89,55.63 R10.P$2 173.74,52.83 175.51,52.83 C10.2 C8.2 177.8,31.75 C7.2 177.8,26.67 C9.2 JP2.1
GNDA
  Top 0.762: JP3.1 13.97,55.88 | JP3.3 19.05,55.88 | JP3.5 24.13,55.88 | U$2.GND@0 39.37,3.81
  Top 1.016: JP3.1 5.08,57.15 JP5.1 | 18.03,54.61 17.78,54.36 13.97,54.36 13.97,55.88 | 18.03,54.61 19.05,55.63 19.05,55.88 | 24.13,55.63 22.86,54.36 19.81,54.36 | 19.81,54.36 18.29,54.36 18.03,54.61 | 24.13,55.63 24.13,55.88 | IC5.5 IC5.4 48.26,77.47 BR2.- 40.39,69.6 40.39,69.34 36.58,65.53 36.58,54.36 25.4,54.36 24.13,55.63 | IC7.3 105.41,83.82 | 105.41,83.82 IC7.4 IC7.5 | 105.41,83.82 C24.2 | 120.65,59.69 118.11,57.15 J1.2 | 120.65,59.69 IC6.4 IC6.5 | 120.65,59.69 C22.2 | 39.37,3.81 C11.- | IC9.5 C29.2 C27.2 105.41,30.48 IC8.5 | C13.2 44.2,21.84 44.2,38.1 IC3.3 31.24,38.1 19.81,49.53 19.81,54.36
  Bottom 0.762: C14.- 44.96,14.73 44.7,14.73 44.45,14.99
  Bottom 1.016: IC5.5 48.26,90.17 C18.2 | IC5.4 48.26,74.93 C17.2 | C25.2 104.14,72.39 IC7.5 104.14,78.74 115.57,78.74 121.92,72.39 | 121.92,72.39 IC6.5 | C23.2 121.92,72.39 | C12.2 24.13,13.97 IC1.2 31.24,13.97 34.04,11.18 38.35,11.18 C11.- 40.39,11.18 40.64,11.18 44.45,14.99 47.75,18.29 | C13.2 47.75,18.29 | 47.75,18.29 52.07,13.97 IC2.2 68.58,13.97 R19.P$1 R20.P$1 84.07,23.11 106.43,23.11 C29.2 | J1.2 117.09,54.86 104.14,54.86 100.08,50.8 100.08,47.24 99.06,46.23 99.06,35.56 IC8.5
GNDI
  Top 0.381: IC9.3 107.95,8.89 | 107.95,8.89 IC9.4 | 107.95,8.89 C28.2 | C26.2 106.68,44.45 IC8.4 105.66,43.18 107.19,41.66 119.13,41.66 119.13,20.57 123.19,16.51 R16.P$1 125.98,12.45 125.98,11.18 IC4.2 126.75,10.16 126.75,6.1 C16.2
  Bottom 0.381: J2.2 149.61,7.87 129.03,7.87 127,9.91 IC4.2 | IC9.3 112.78,5.33 122.94,5.33 C16.2
HH  (via drill 0.61)
  Top 0.381: IC3.7 50.8,40.64 v50.8,48.26
  Bottom 0.381: v50.8,48.26 51.31,48.77 63.25,48.77 64.26,49.78 64.26,53.85 56.13,53.85 55.12,54.86 55.12,60.96 R6.P$2
HL  (via drill 0.61)
  Top 1.016: Q1.3 146.3,93.73 146.3,87.63 | 146.3,87.63 142.49,83.82 U$5.C | v101.09,59.18 v97.03,55.12 | v131.57,63.5 134.11,66.04 134.11,74.42 U$4.A | TR1.2 151.38,87.38 146.56,87.38 146.3,87.63
  Bottom 0.762: 53.34,38.1 C15.-
  Bottom 1.016: Q2.2 165.1,78.74 TR1.2 | C4.2 134.62,83.82 135.89,83.82 | U$5.C 135.89,83.82 | IC3.6 53.34,38.1 70.87,38.1 79.5,46.74 88.65,46.74 v97.03,55.12 | v101.09,59.18 103.38,61.47 118.36,61.47 120.4,63.5 v131.57,63.5 | U$4.A 135.89,83.82
LH
  Bottom 0.381: IC3.4 40.89,35.81 41.91,35.81 46.23,40.13 46.23,46.48 76.45,46.48 78.74,48.77 86.11,48.77 87.12,49.78 87.12,53.85 66.29,53.85 64.26,55.88 R7.P$2
N$1
  Top 1.016: TR2.2 TR2.3
N$2
  Top 1.016: R21.2 13.72,67.06 13.72,83.57 TR3.3
N$3
  Top 1.016: R2.P$1 R3.P$2 | C1.2 C2.1
  Bottom 1.016: R3.P$2 69.85,82.55 C1.2 | C2.1 84.33,66.8 96.01,66.8 97.79,65.02 C3.1
N$4
  Bottom 0.381: IC4.1 124.46,13.72 134.11,13.72 134.75,14.35 | 134.75,14.35 134.87,14.48 134.87,19.05 R15.P$1 | J3.2 149.35,13.21 135.89,13.21 134.75,14.35
N$5
  Top 1.016: TR3.2 4.06,88.65 4.06,93.98 X1.1
N$6  (via drill 0.61)
  Top 1.016: D4.1 106.68,66.8 107.95,68.07 111.76,68.07 | D4.3 111.76,68.07 | R4.1 112.01,68.83 112.01,68.33 111.76,68.07 | v101.09,67.06 98.3,69.85 98.3,86.87 97.79,87.38 C3.2
  Bottom 1.016: v101.09,67.06 103.38,64.77 D4.1
N$7
  Top 1.016: R5.2 121.92,86.36 C4.1
N$8
  Top 1.016: JP1.1 6.35,68.58 TR3.1
N$9
  Bottom 1.016: TR3.4 7.37,64.52 5.59,64.52 5.08,64.01 JP1.2
N$10  (via drill 0.61)
  Top 0.381: R6.P$1 78.49,69.6 78.49,83.57 v90.68,95.76
  Bottom 0.381: v90.68,95.76 92.96,98.04 136.91,98.04 Q1.1
N$11
  Bottom 0.381: R7.P$1 70.87,56.9 96.01,56.9 96.27,57.15 116.08,57.15 117.09,58.17 119.13,58.17 120.9,56.39 120.9,54.86 133.86,54.86 138.43,59.44 138.43,68.58 138.68,68.58 145.8,75.69 152.91,75.69 173.74,96.52 Q2.1
N$12
  Bottom 2.794: R8.P$1 148.59,41.91 C5.1
N$13
  Top 2.794: D2.1 139.7,49.02 140.97,50.29 144.78,50.29 | D2.3 144.78,50.29 | R8.P$2 158.75,55.88 TR1.3 157.48,56.64 147.32,56.64 145.29,54.61 145.29,51.56 144.78,50.29
N$14
  Top 5.08: C10.1 C8.1 C7.1 C9.1 182.88,12.19 | 182.88,12.19 182.88,5.08 JP2.2 | 162.56,12.7 J3.1 | L4.2 162.56,12.7 | 182.88,12.19 164.85,12.19 162.56,12.7
N$15  (via drill 0.61)
  Top 0.762: BR2.AC1 43.69,61.72 54.86,61.72 54.86,68.33 | 54.86,68.33 54.86,68.83 TR2.7 | v73.66,89.41 73.66,72.39 69.6,68.33 54.86,68.33
  Bottom 0.762: TR2.5 66.8,89.41 v73.66,89.41
N$16
  Bottom 2.794: R14.P$1 129.03,44.96 132.08,44.96 R9.P$1 134.37,43.69 142.24,43.69 D2.2
N$17
  Top 2.794: C6.1 R10.P$1
N$19
  Top 2.794: C6.2 170.18,49.53 170.43,49.28 174.24,49.28 174.24,58.17 TR1.5
  Bottom 2.794: D3.1 140.21,15.24 138.94,16.51 138.94,20.32 D3.3 142.75,21.59 166.37,45.21 C6.2
N$20
  Bottom 0.762: BR2.AC2 46.99,71.12 61.47,71.12 | 61.47,71.12 63.5,71.12 TR2.8 | TR2.6 61.47,81.79 61.47,71.12
N$21
  Top 0.762: IC1.1 37.08,11.43 C11.+
  Bottom 0.762: IC2.1 52.07,7.62 33.02,7.62 IC1.1 | 11.18,62.23 25.15,62.23 29.72,66.8 43.69,66.8 BR2.+ | 11.18,62.23 7.37,62.23 5.08,59.94 JP5.2 | C11.+ 30.48,22.61 15.75,22.61 11.18,27.18 11.18,62.23
N$23
  Top 2.794: R14.P$2 128.27,34.29 | 128.27,34.29 C21.1 | 128.27,34.29 J5.1
N$26  (via drill 0.61)
  Top 0.381: D1.C 57.66,36.32 v57.66,41.15
  Bottom 0.381: IC3.8 49.53,44.45 C15.+ 54.36,44.45 v57.66,41.15
PWM9
  Top 0.381: IC3.2 37.85,40.64 U$2.9
PWM10
  Bottom 0.381: IC3.1 35.05,48.77 35.05,50.8 U$2.10
RS  (via drill 0.61)
  Top 0.381: U$2.3 55.12,50.29 55.12,45.47 55.88,44.7 v55.88,35.31
  Bottom 0.381: v55.88,35.31 51.56,30.99 39.37,30.99 20.57,49.78 20.57,55.12 21.59,56.13 JP3.4
SII1
  Top 0.381: R13.P$1 38.35,70.1 38.35,78.99 C19.+
  Bottom 0.381: IC5.2 53.34,76.45 51.82,74.93 51.82,72.64 47.75,72.64 40.64,79.76 C19.+
SII2  (via drill 0.61)
  Top 0.762: 40.64,95 C19.-
  Top 1.016: Q1.2 135.89,88.9 U$4.C | v57.91,82.04 61.21,85.34 61.21,92.71 63.25,94.74 | 63.25,94.74 63.5,95 68.58,95 R2.P$2 | R1.P$2 30.73,90.42 30.73,92.71 33.02,95 40.64,95 62.99,95 63.25,94.74
  Bottom 1.016: IC5.3 50.8,82.04 v57.91,82.04 | R2.P$2 80.01,93.98 C1.1 R11.P$1 95.5,95.5 134.37,95.5 U$4.C
SIP1
  Top 0.381: IC6.2 126.75,60.71 126.75,58.42 126.24,57.91 126.24,56.39 126.36,56.26 | 126.36,56.26 127.51,55.12 135.89,55.12 C20.+ | D4.2 109.47,64.52 109.47,61.21 117.09,53.59 126.24,53.59 126.24,56.13 126.36,56.26
SIP2  (via drill 0.61)
  Top 1.016: v124.46,65.79 IC6.3
  Bottom 0.762: C20.- 135.89,65.79 132.33,65.79 132.08,66.04
  Bottom 1.016: v124.46,65.79 124.71,66.04 132.08,66.04 135.38,69.34 | 135.38,69.34 R4.2 137.41,71.37 138.68,71.37 TR1.1 | R5.1 119.63,81.03 120.9,81.03 126.75,75.18 129.54,75.18 135.38,69.34
SIS1
  Bottom 0.381: IC8.2 112.01,41.66 115.82,41.66 J5.2
SIS2
  Bottom 0.381: IC8.3 109.47,44.7 126.49,44.7 133.1,38.1 J4.2
SVBUS
  Top 0.381: IC7.2 108.97,84.07 108.97,86.36 108.46,86.87 108.46,91.95 R12.P$2 R11.P$2
SVO
  Bottom 0.381: IC9.2 113.28,10.41 117.09,10.41 121.67,14.99 121.67,19.05 R15.P$2 129.54,19.05 R16.P$2

### Text on the board
tValues: + | -